# Altium schematic sheet Power.SchDoc
size A; SheetNumber: 1; SheetTotal: 5
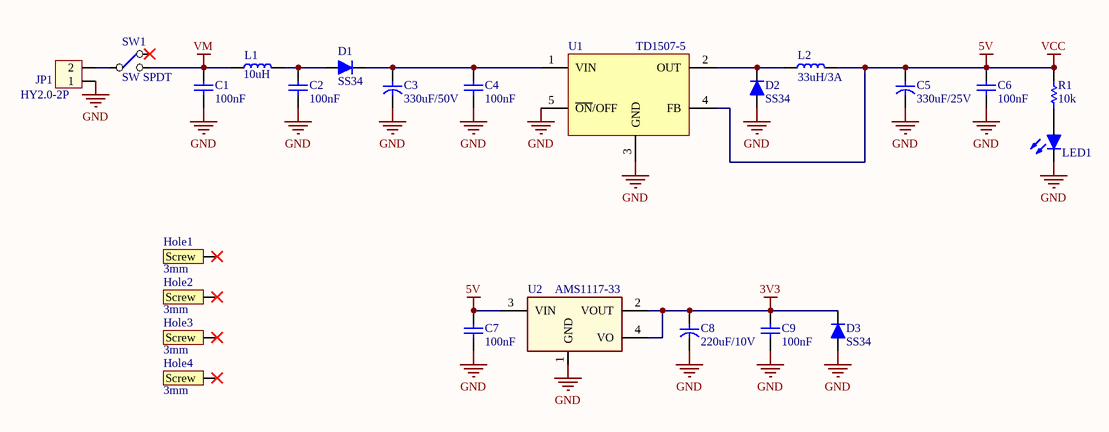
[diagram p0: Power.SchDoc]

## Parts
C1  100nF  [C 0603 (1608)]
C2  100nF  [C 0603 (1608)]
C3  330uF/50V  [C SMD ALU (G)]
C4  100nF  [C 0603 (1608)]
C5  330uF/25V  [C SMD ALU (F)]
C6  100nF  [C 0603 (1608)]
C7  100nF  [C 0603 (1608)]
C8  220uF/10V  [C SMD ALU (D)]
C9  100nF  [C 0603 (1608)]
D1  SS34  [DO-214AC (SMA)]
D2  SS34  [DO-214AC (SMA)]
D3  SS34  [DO-214AC (SMA)]
Hole1  3mm  [SCREW/3M/7M]
Hole2  3mm  [SCREW/3M/7M]
Hole3  3mm  [SCREW/3M/7M]
Hole4  3mm  [SCREW/3M/7M]
JP1  HY2.0-2P  [HY2.0-2P-RA]
L1  10uH  [Inductor SMD 0420]
L2  33uH/3A  [Inductor SMD 10x10x5]
LED1  Led-Red  [Led SMD 0603]  (value not drawn)
R1  10k  [R 0603 (1608)]
SW1  SW SPDT  [SW/3/SPDT/SS12D11]
U1  TD1507-5  [TO-252-5]
U2  AMS1117-33  [SOT-223]

## Nets
3V3: C8.1 C9.1 D3.2(K) U2.2(VOUT) U2.4(VO)
5V: C5.1 C6.1 C7.1 L2.2 R1.2 U1.4(FB) U2.3(VIN)  [also labelled VCC]
GND: C1.2 C2.2 C3.2 C4.2 C5.2 C6.2 C7.2 C8.2 C9.2 D2.1(A) D3.1(A) JP1.1 LED1.2(K) U1.3(GND) U1.5(~{ON}/OFF) U1.6(GND) U2.1(GND)
VM: C1.1 L1.1 SW1.3(NO1)
NetC2_1: C2.1 D1.1(A) L1.2
NetC3_1: C3.1 C4.1 D1.2(K) U1.1(VIN)
NetD2_2: D2.2(K) L2.1 U1.2(OUT)
NetJP1_2: JP1.2 SW1.2(COMMON1)
NetLED1_1: LED1.1(A) R1.1

Not connected (* = marked no-connect by the designer): Hole1 1(Screw)*; Hole2 1(Screw)*; Hole3 1(Screw)*; Hole4 1(Screw)*; SW1 1(NC1)*

## Library data of the parts
C1 C2 C4 C6 C7 C9 = Capacitor NP: Capacitor non-pol
C3 C5 C8 = Capacitor: Capacitor pol
D1-D3 = Diode: Default Diode; Published: 8-Jun-2000; LatestRevisionDate: 17-Jul-2002; LatestRevisionNote: Re-released for DXP Platform.; PackageVersion: Sep-1996; PackageReference: SMC; Publisher: Altium Limited; Code_JEDEC: DO-214-AB
Hole1-Hole4 = Screw
JP1 = Con2: Connector 2; Value: Connector 2
L1 L2 = Inductor
LED1 = Led: Typical LED
R1 = Resistor: Published: 8-Jun-2000; LatestRevisionDate: 17-Jul-2002; LatestRevisionNote: Re-released for DXP Platform.; PackageReference: AXIAL-0.3; Publisher: Altium Limited
U1 = TD1507: 4A 300KHz 32V Buck DC to DC Converter
U2 = AMS1117: 1A LDO Voltage Regulator, ADJ or fixed 1.5/1.8/2.5/2.85/3.3/5V